# EAGLE schematic 1117_Adj_SMD_0603 (EAGLE 9.6.2)
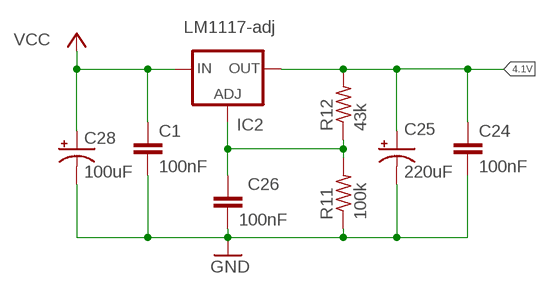
[diagram p0: schematic, sheet 1]

## Parts
C1  100nF  C-EUC0603  [C0603]
C24  100nF  C-EUC0603  [C0603]
C25  220uF  CPOL-USUD-6,3X7,7  [UD-6,3X7,7_NICHICON]
C26  100nF  C-EUC0603  [C0603]
C28  100uF  CPOL-USUD-6,3X7,7  [UD-6,3X7,7_NICHICON]
IC2  LM1117-adj  LD117AS25TR  [SOT223]
R11  100k  R-US_R0603  [R0603]
R12  43k  R-US_R0603  [R0603]

## Nets
4.1V: C24.1 C25.+ IC2.4(OUT) R12.2
GND: C1.2 C24.2 C25.- C26.2 C28.- R11.1
N$5: C26.1 IC2.1(ADJ) R11.2 R12.1
VCC: C1.1 C28.+ IC2.3(IN)

## Library data of the parts
C1 C24 C26 = rcl:C-EU: CAPACITOR, European symbol; SPICEPREFIX: C
C25 C28 = rcl:CPOL-US: POLARIZED CAPACITOR, American symbol; SPICEPREFIX: C
IC2 = v-reg:LD117A?*: Low drop fixed and adjustable positive voltage regulators 1 A Source: http://www.st.com/stonline/products/literature/ds/7194/ld1117axx.pdf
R11 R12 = rcl:R-US_: RESISTOR, American symbol; SPICEPREFIX: R

## Net classes
1 vcc: width 0.254 mm